# EAGLE design M930C (EAGLE 6.6.0)
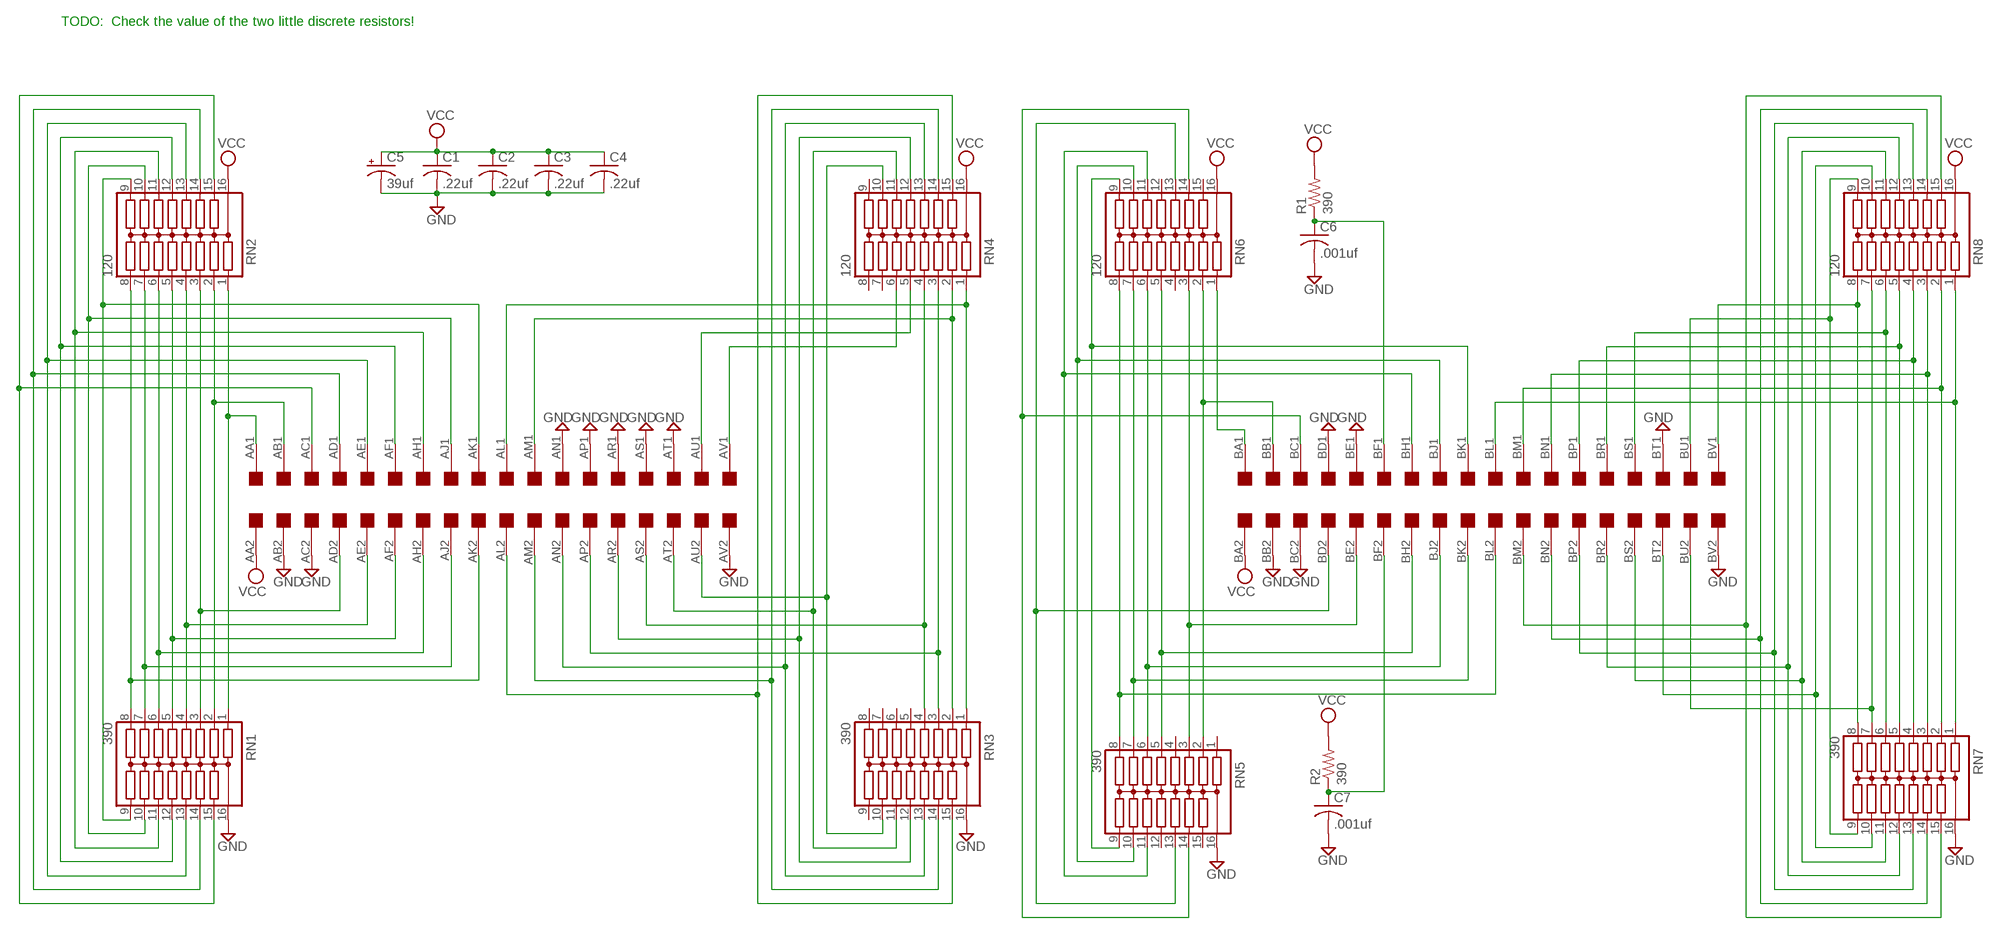
[diagram p0: schematic, sheet 1]

## Parts
C1  .22uf  C-US050-025X075  [C050-025X075]
C2  .22uf  C-US050-025X075  [C050-025X075]
C3  .22uf  C-US050-025X075  [C050-025X075]
C4  .22uf  C-US050-025X075  [C050-025X075]
C5  39uf  CPOL-USE15-5AXIAL  [E15-5]
C6  .001uf  C-US050-025X075  [C050-025X075]
C7  .001uf  C-US050-025X075  [C050-025X075]
R1  390  R-US_0207/10  [0207/10]
R2  390  R-US_0207/10  [0207/10]
RN1  390  15R  [DIL16]
RN2  120  15R  [DIL16]
RN3  390  15R  [DIL16]
RN4  120  15R  [DIL16]
RN5  390  15R  [DIL16]
RN6  120  15R  [DIL16]
RN7  390  15R  [DIL16]
RN8  120  15R  [DIL16]
U$1  DOUBLE  [EDGE-CON4]

## Nets
AA1: RN1.1 RN2.1 U$1.AA1
AB1: RN1.2 RN2.2 U$1.AB1
AC1: RN1.15 RN2.15 U$1.AC1
AD1: RN1.14 RN2.14 U$1.AD1
AD2: RN1.3 RN2.3 U$1.AD2
AE1: RN1.13 RN2.13 U$1.AE1
AE2: RN1.4 RN2.4 U$1.AE2
AF1: RN1.12 RN2.12 U$1.AF1
AF2: RN1.5 RN2.5 U$1.AF2
AH1: RN1.11 RN2.11 U$1.AH1
AH2: RN1.6 RN2.6 U$1.AH2
AJ1: RN1.10 RN2.10 U$1.AJ1
AJ2: RN1.7 RN2.7 U$1.AJ2
AK1: RN1.9 RN2.9 U$1.AK1
AK2: RN1.8 RN2.8 U$1.AK2
AL1: RN3.1 RN4.1 U$1.AL1
AL2: RN3.15 RN4.15 U$1.AL2
AM1: RN3.2 RN4.2 U$1.AM1
AM2: RN3.14 RN4.14 U$1.AM2
AN2: RN3.13 RN4.13 U$1.AN2
AP2: RN3.3 RN4.3 U$1.AP2
AR2: RN3.12 RN4.12 U$1.AR2
AS2: RN3.4 RN4.4 U$1.AS2
AT2: RN3.11 RN4.11 U$1.AT2
AU1: RN4.5 U$1.AU1
AU2: RN3.10 RN4.10 U$1.AU2
AV1: RN4.6 U$1.AV1
BA1: RN6.1 U$1.BA1
BB1: RN5.2 RN6.2 U$1.BB1
BC1: RN5.14 RN6.14 U$1.BC1
BD2: RN5.13 RN6.13 U$1.BD2
BE2: RN5.3 RN6.3 U$1.BE2
BH1: RN5.11 RN6.11 U$1.BH1
BH2: RN5.5 RN6.5 U$1.BH2
BJ1: RN5.10 RN6.10 U$1.BJ1
BJ2: RN5.6 RN6.6 U$1.BJ2
BK1: RN5.9 RN6.9 U$1.BK1
BK2: RN5.7 RN6.7 U$1.BK2
BL1: RN7.1 RN8.1 U$1.BL1
BL2: RN5.8 RN6.8 U$1.BL2
BM1: RN7.2 RN8.2 U$1.BM1
BM2: RN7.15 RN8.15 U$1.BM2
BN1: RN7.3 RN8.3 U$1.BN1
BN2: RN7.14 RN8.14 U$1.BN2
BP1: RN7.4 RN8.4 U$1.BP1
BP2: RN7.13 RN8.13 U$1.BP2
BR1: RN7.5 RN8.5 U$1.BR1
BR2: RN7.12 RN8.12 U$1.BR2
BS1: RN7.6 RN8.6 U$1.BS1
BS2: RN7.11 RN8.11 U$1.BS2
BT2: RN7.10 RN8.10 U$1.BT2
BU1: RN7.9 RN8.9 U$1.BU1
BU2: RN7.7 RN8.7 U$1.BU2
BV1: RN7.8 RN8.8 U$1.BV1
GND: C1.2 C2.2 C3.2 C4.2 C5.- C6.2 C7.2 RN1.16 RN3.16 RN5.16 RN7.16 U$1.AB2 U$1.AC2 U$1.AN1 U$1.AP1 U$1.AR1 U$1.AS1 U$1.AT1 U$1.AV2 U$1.BB2 U$1.BC2 U$1.BD1 U$1.BE1 U$1.BT1 U$1.BV2
N$1: C7.1 R2.1 U$1.BF2
N$2: C6.1 R1.1 U$1.BF1
VCC: C1.1 C2.1 C3.1 C4.1 C5.+ R1.2 R2.2 RN2.16 RN4.16 RN6.16 RN8.16 U$1.AA2 U$1.BA2
Unconnected: RN3.5 RN3.6 RN3.7 RN3.8 RN3.9 RN4.7 RN4.8 RN4.9 RN5.1 RN5.4 RN5.12 RN5.15 RN6.4 RN6.12 RN6.15

## Notes on the sheet
- TODO:  Check the value of the two little discrete resistors!

## Library data of the parts
C1-C4 C6 C7 = rcl:C-US: CAPACITOR, American symbol
C5 = rcl:CPOL-US: POLARIZED CAPACITOR, American symbol
R1 R2 = rcl:R-US_: RESISTOR, American symbol
RN1-RN8 = resistor-dil:15R: DIL RESISTOR; OC_FARNELL: unknown; OC_NEWARK: unknown
U$1 = dec-con:DOUBLE: Double-Height DEC board

## Board
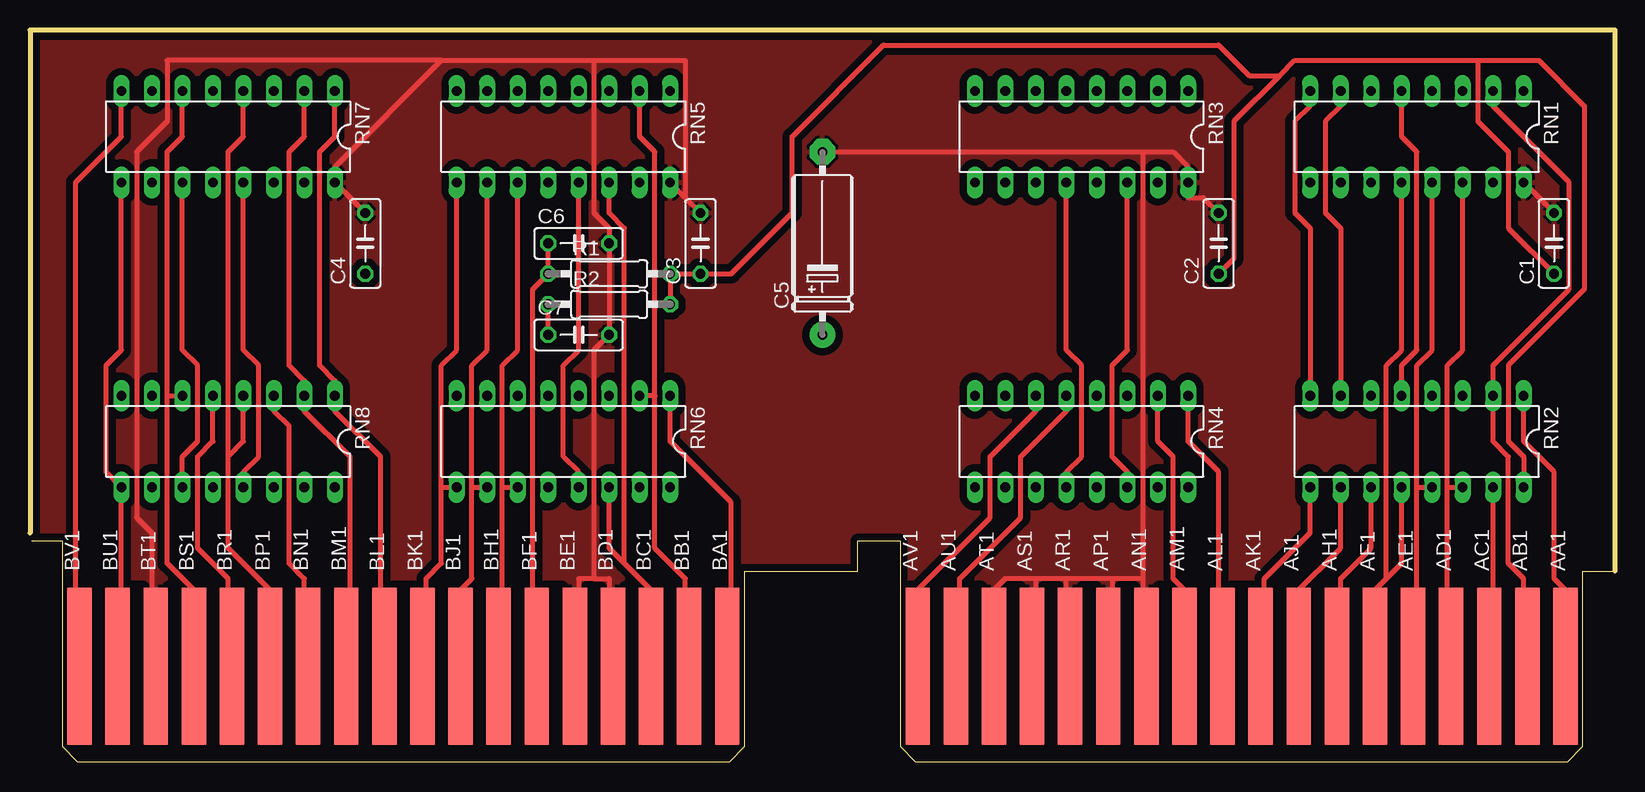
[diagram p1: board, top side]
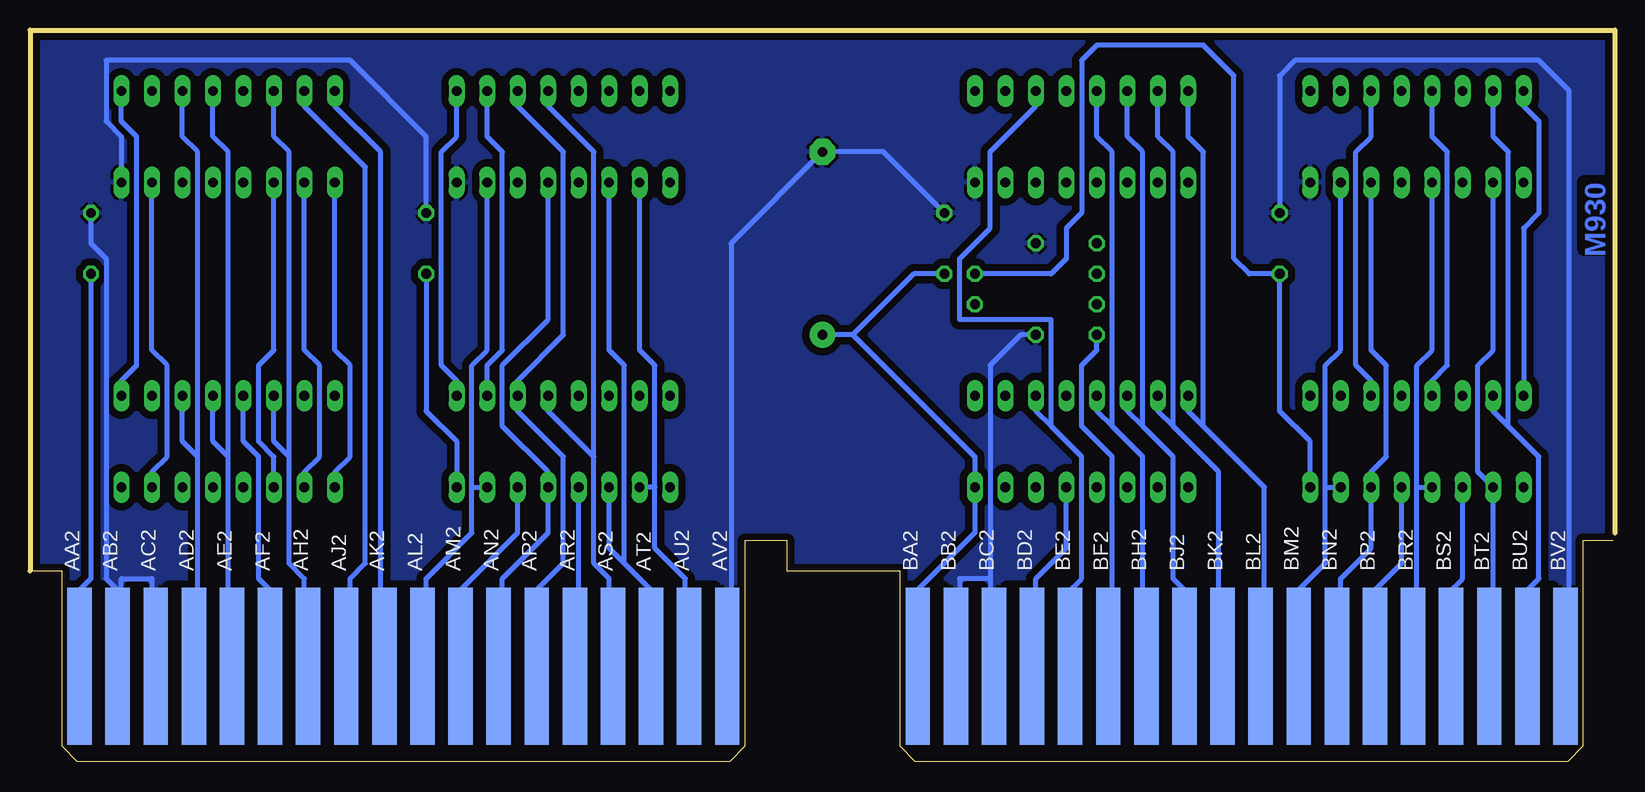
[diagram p2: board, bottom side, seen from below]

Size 132.08 x 60.96 mm. Coordinates in mm from the lower left corner, seen from the top.
Outline: 132.08,15.88 132.08,60.96 0,60.96 0,19.05
Copper layers (1+16): Top 0.035mm / dielectric 1.5mm / Bottom 0.035mm
Design rules "16mils": minimum track width 16mil, minimum drill 32mil, track to track 15mil, track to pad 10mil, pad to pad 10mil, via to via 10mil, smd to smd 10mil, copper to edge 13mil, drill to drill 10mil, minimum pad ring 10mil, minimum via ring 8mil, stop-mask expansion 0mil, vias tented up to drill 0mil, thermal gap 10mil

### Footprints (pad centres in the part's own frame; a part is rotated, then mirrored left to right if it is on the bottom)
C050-025X075 = drill 0.813 octagon: 1 -2.54,0; 2 2.54,0
E15-5 = drill 0.813 pad 2.159: + -7.62,0 | drill 0.813 pad 2.159 octagon: - 7.62,0
0207/10 = drill 0.813 octagon: 1 -5.08,0; 2 5.08,0
DIL16 = drill 0.813 long: 1 -8.89,-3.81; 2 -6.35,-3.81; 3 -3.81,-3.81; 4 -1.27,-3.81; 5 1.27,-3.81; 6 3.81,-3.81; 7 6.35,-3.81; 8 8.89,-3.81; 9 8.89,3.81; 10 6.35,3.81; 11 3.81,3.81; 12 1.27,3.81; 13 -1.27,3.81; 14 -3.81,3.81; 15 -6.35,3.81; 16 -8.89,3.81
EDGE-CON4 = smd 13.106 x 2.032: AA1 7.938,4.128; AB1 7.938,7.303; AC1 7.938,10.477; AD1 7.938,13.652; AE1 7.938,16.828; AF1 7.938,20.003; AH1 7.938,23.177; AJ1 7.938,26.352; AK1 7.938,29.527; AL1 7.938,32.703; AM1 7.938,35.877; AN1 7.938,39.053; AP1 7.938,42.227; AR1 7.938,45.403; AS1 7.938,48.578; AT1 7.938,51.752; AU1 7.938,54.928; AV1 7.938,58.102; BA1 7.938,73.978; BB1 7.938,77.153; BC1 7.938,80.328; BD1 7.938,83.502; BE1 7.938,86.677; BF1 7.938,89.853; BH1 7.938,93.028; BJ1 7.938,96.203; BK1 7.938,99.377; BL1 7.938,102.552; BM1 7.938,105.728; BN1 7.938,108.903; BP1 7.938,112.078; BR1 7.938,115.252; BS1 7.938,118.427; BT1 7.938,121.603; BU1 7.938,124.778; BV1 7.938,127.953 | smd 13.106 x 2.032 bottom: AA2 7.938,4.128; AB2 7.938,7.303; AC2 7.938,10.477; AD2 7.938,13.652; AE2 7.938,16.828; AF2 7.938,20.003; AH2 7.938,23.177; AJ2 7.938,26.352; AK2 7.938,29.527; AL2 7.938,32.703; AM2 7.938,35.877; AN2 7.938,39.053; AP2 7.938,42.227; AR2 7.938,45.403; AS2 7.938,48.578; AT2 7.938,51.752; AU2 7.938,54.928; AV2 7.938,58.102; BA2 7.938,73.978; BB2 7.938,77.153; BC2 7.938,80.328; BD2 7.938,83.502; BE2 7.938,86.677; BF2 7.938,89.853; BH2 7.938,93.028; BJ2 7.938,96.203; BK2 7.938,99.377; BL2 7.938,102.552; BM2 7.938,105.728; BN2 7.938,108.903; BP2 7.938,112.078; BR2 7.938,115.252; BS2 7.938,118.427; BT2 7.938,121.603; BU2 7.938,124.778; BV2 7.938,127.953

### Placement (x,y rotation side)
C1  127,43.18 90 top
C2  99.06,43.18 90 top
C3  55.88,43.18 90 top
C4  27.94,43.18 90 top
C5  66.04,43.18 90 top
C6  45.72,43.18 0 top
C7  45.72,35.56 0 top
R1  48.26,40.64 0 top
R2  48.26,38.1 0 top
RN1  115.57,52.07 180 top
RN2  115.57,26.67 180 top
RN3  87.63,52.07 180 top
RN4  87.63,26.67 180 top
RN5  44.45,52.07 180 top
RN6  44.45,26.67 180 top
RN7  16.51,52.07 180 top
RN8  16.51,26.67 180 top
U$1  132.08,0 90 top

### Tracks (layer width: path | path; a pad name or v marks a point on that pad's centre or on a via)
AA1
  Top 0.406: RN2.1 124.46,26.67 127,24.13 127,15.24 128.27,13.97 U$1.AA1
  Bottom 0.406: RN1.1 124.46,53.34 123.19,52.07 123.19,33.02 124.46,31.75 RN2.1
AB1
  Top 0.406: U$1.AB1 124.46,13.97 124.46,15.24 123.19,16.51 123.19,25.4 121.92,26.67 RN2.2 121.92,33.02 128.27,39.37 128.27,48.26 121.92,54.61 RN1.2
AC1
  Top 0.406: RN2.15 121.92,21.59 121.92,13.97 U$1.AC1
  Bottom 0.406: RN1.15 121.92,46.99 121.92,34.29 120.65,33.02 120.65,25.4 121.92,24.13 RN2.15
AD1
  Top 0.406: 118.11,22.86 RN2.14 | 118.11,13.97 118.11,8.89 118.43,8.57 U$1.AD1 118.11,13.97 | RN1.14 119.38,34.29 118.11,33.02 118.11,22.86 | 118.11,13.97 118.11,22.86
AD2
  Bottom 0.406: 118.11,25.4 119.38,26.67 119.38,29.21 RN2.3 | 118.11,25.4 118.11,13.97 U$1.AD2 | 118.11,25.4 118.11,50.8 119.38,52.07 119.38,54.61 RN1.3
AE1
  Top 0.406: 115.57,22.86 RN2.13 | RN1.13 116.84,34.29 115.57,33.02 115.57,22.86 | 115.57,22.86 115.57,13.97 U$1.AE1
AE2
  Bottom 0.406: 115.57,25.4 116.84,26.67 116.84,29.21 RN2.4 | 115.57,25.4 115.57,13.97 U$1.AE2 | 115.57,25.4 115.57,50.8 116.84,52.07 116.84,54.61 RN1.4
AF1
  Top 0.406: 113.03,15.24 111.76,13.97 U$1.AF1 | 113.03,15.24 114.3,16.51 114.3,21.59 RN2.12 | 113.03,15.24 113.03,33.02 114.3,34.29 114.3,46.99 RN1.12
AF2
  Top 0.406: RN1.5 114.3,52.07 115.57,50.8 115.57,34.29 114.3,33.02 RN2.5
  Bottom 0.406: RN2.5 114.3,26.67 113.03,25.4 113.03,15.24 111.76,13.97 U$1.AF2
AH1
  Top 0.406: RN2.11 111.76,17.78 109.22,15.24 109.22,13.97 U$1.AH1
  Bottom 0.406: RN1.11 111.76,34.29 113.03,33.02 113.03,26.67 111.76,25.4 RN2.11
AH2
  Bottom 0.406: RN2.6 111.76,26.67 110.49,25.4 | 110.49,25.4 110.49,16.51 109.22,15.24 109.22,13.97 U$1.AH2 | RN1.6 111.76,52.07 110.49,50.8 110.49,25.4
AJ1
  Top 0.406: RN2.10 109.22,21.59 109.22,17.78 105.41,13.97 U$1.AJ1
  Bottom 0.406: RN1.10 109.22,46.99 109.22,34.29 107.95,33.02 107.95,25.4 109.22,24.13 RN2.10
AJ2
  Top 0.406: RN2.7 109.22,44.45 107.95,45.72 107.95,53.34 109.22,54.61 RN1.7
  Bottom 0.406: RN1.7 109.22,54.61 104.14,49.53 104.14,16.51 105.41,15.24 105.41,13.97 U$1.AJ2
AK1
  Top 0.406: RN2.9 106.68,19.05 102.87,15.24 102.87,13.97 U$1.AK1
  Bottom 0.406: RN1.9 106.68,34.29 105.41,33.02 105.41,25.4 106.68,24.13 RN2.9
AK2
  Top 0.406: RN2.8 106.68,31.75 106.68,44.45 105.41,45.72 105.41,53.34 106.68,54.61 RN1.8
  Bottom 0.406: RN1.8 106.68,54.61 102.87,50.8 102.87,13.97 U$1.AK2
AL1
  Top 0.406: RN4.1 96.52,29.21 96.52,26.67 99.06,24.13 99.06,13.97 U$1.AL1
  Bottom 0.406: RN3.1 96.52,54.61 96.52,52.07 97.79,50.8 97.79,33.02 96.52,31.75 RN4.1
AL2
  Bottom 0.406: 95.25,22.86 RN4.15 | U$1.AL2 99.06,13.97 99.06,15.24 95.25,19.05 95.25,22.86 | RN3.15 93.98,34.29 95.25,33.02 95.25,22.86
AM1
  Top 0.406: RN4.2 93.98,26.67 95.25,25.4 95.25,15.24 96.52,13.97 U$1.AM1
  Bottom 0.406: RN3.2 93.98,52.07 92.71,50.8 92.71,34.29 93.98,33.02 RN4.2
AM2
  Top 0.406: RN3.14 91.44,46.99 91.44,34.29 90.17,33.02 90.17,25.4 91.44,24.13 RN4.14
  Bottom 0.406: RN4.14 91.44,21.59 91.44,19.05 96.52,13.97 U$1.AM2
AN2
  Bottom 0.406: U$1.AN2 92.71,13.97 92.71,15.24 88.9,19.05 RN4.13 88.9,24.13 92.71,27.94 92.71,33.02 88.9,36.83 RN3.13
AP2
  Bottom 0.406: U$1.AP2 90.17,13.97 87.63,16.51 87.63,25.4 91.44,29.21 RN4.3 91.44,31.75 87.63,35.56 87.63,50.8 91.44,54.61 RN3.3
AR2
  Top 0.406: RN3.12 86.36,46.99 86.36,34.29 87.63,33.02 87.63,25.4 86.36,24.13 RN4.12
  Bottom 0.406: RN4.12 86.36,21.59 86.36,13.97 U$1.AR2
AS2
  Bottom 0.406: 85.09,25.4 88.9,29.21 RN4.4 | 85.09,25.4 85.09,16.51 83.82,15.24 83.82,13.97 U$1.AS2 | 85.09,25.4 85.09,50.8 88.9,54.61 RN3.4
AT2
  Bottom 0.406: 82.55,16.51 80.01,13.97 U$1.AT2 | 82.55,16.51 83.82,17.78 83.82,21.59 RN4.11 | 82.55,16.51 82.55,33.02 83.82,34.29 83.82,46.99 RN3.11
AU1
  Top 0.406: RN4.5 86.36,29.21 82.55,25.4 82.55,20.32 77.47,15.24 77.47,13.97 U$1.AU1
AU2
  Bottom 0.406: 80.01,22.86 RN4.10 | U$1.AU2 77.47,13.97 77.47,15.24 80.01,17.78 80.01,22.86 | RN3.10 81.28,34.29 80.01,33.02 80.01,22.86
AV1
  Top 0.406: RN4.6 83.82,29.21 80.01,25.4 80.01,20.32 73.66,13.97 U$1.AV1
BA1
  Top 0.406: RN6.1 53.34,26.67 58.42,21.59 58.42,12.7 U$1.BA1
BB1
  Top 0.406: 52.07,30.48 RN6.2 | 52.07,30.48 52.07,17.78 54.61,15.24 54.61,13.97 U$1.BB1 | RN5.2 50.8,52.07 52.07,50.8 52.07,30.48
BC1
  Top 0.406: 49.53,16.51 52.07,13.97 U$1.BC1 | 49.53,16.51 48.26,17.78 48.26,21.59 RN6.14 | 49.53,16.51 49.53,44.45 48.26,45.72 48.26,46.99 RN5.14
BD2
  Top 0.406: RN5.13 45.72,34.29 44.45,33.02 44.45,25.4 45.72,24.13 RN6.13
  Bottom 0.406: RN6.13 45.72,17.78 48.26,15.24 48.26,13.97 U$1.BD2
BE2
  Bottom 0.406: 46.99,27.94 44.45,25.4 44.45,15.24 45.72,13.97 U$1.BE2 | 46.99,27.94 48.26,29.21 RN6.3 | 46.99,27.94 46.99,36.83 54.61,36.83 54.61,41.91 52.07,44.45 52.07,50.8 48.26,54.61 RN5.3
BH1
  Top 0.406: 39.37,22.86 RN6.11 | RN5.11 40.64,34.29 39.37,33.02 39.37,22.86 | U$1.BH1 39.05,13.65 39.37,13.97 39.37,22.86
BH2
  Bottom 0.406: 41.91,27.94 39.37,25.4 39.37,13.97 U$1.BH2 | 41.91,27.94 43.18,29.21 RN6.5 | 41.91,27.94 41.91,50.8 43.18,52.07 43.18,54.61 RN5.5
BJ1
  Top 0.406: 36.83,22.86 RN6.10 | U$1.BJ1 35.56,13.97 36.83,15.24 36.83,22.86 | RN5.10 38.1,34.29 36.83,33.02 36.83,22.86
BJ2
  Bottom 0.406: 39.37,27.94 36.83,25.4 36.83,15.24 35.56,13.97 U$1.BJ2 | 39.37,27.94 40.64,29.21 RN6.6 | RN5.6 40.64,52.07 39.37,50.8 39.37,27.94
BK1
  Top 0.406: 34.29,22.86 RN6.9 | U$1.BK1 33.02,13.97 33.02,15.24 34.29,16.51 34.29,22.86 | RN5.9 35.56,34.29 34.29,33.02 34.29,22.86
BK2
  Bottom 0.406: 36.83,27.94 33.02,24.13 33.02,13.97 U$1.BK2 | 36.83,27.94 38.1,29.21 RN6.7 | 36.83,27.94 36.83,50.8 38.1,52.07 38.1,54.61 RN5.7
BL1
  Top 0.406: U$1.BL1 29.21,13.97 29.21,25.4 25.4,29.21 RN8.1 25.4,31.75 24.13,33.02 24.13,50.8 25.4,52.07 25.4,54.61 RN7.1
BL2
  Bottom 0.406: 34.29,27.94 29.21,22.86 29.21,12.7 U$1.BL2 | 34.29,27.94 35.56,29.21 RN6.8 | RN5.8 35.56,52.07 34.29,50.8 34.29,27.94
BM1
  Top 0.406: U$1.BM1 26.67,13.97 26.67,25.4 22.86,29.21 RN8.2 22.86,31.75 21.59,33.02 21.59,50.8 22.86,52.07 22.86,54.61 RN7.2
BM2
  Bottom 0.406: 24.13,22.86 RN8.15 | U$1.BM2 26.67,13.97 24.13,16.51 24.13,22.86 | RN7.15 22.86,34.29 24.13,33.02 24.13,22.86
BN1
  Top 0.406: RN8.3 20.32,29.21 21.59,27.94 21.59,16.51 22.86,15.24 22.86,13.97 U$1.BN1
  Bottom 0.406: RN7.3 20.32,52.07 21.59,50.8 21.59,33.02 20.32,31.75 RN8.3
BN2
  Bottom 0.406: U$1.BN2 22.86,13.97 22.86,15.24 20.32,17.78 RN8.14 20.32,24.13 19.05,25.4 19.05,33.02 20.32,34.29 RN7.14
BP1
  Top 0.406: 16.51,25.4 17.78,26.67 17.78,29.21 RN8.4 | 16.51,25.4 16.51,17.78 20.32,13.97 U$1.BP1 | 16.51,25.4 16.51,50.8 17.78,52.07 17.78,54.61 RN7.4
BP2
  Top 0.406: RN7.13 17.78,46.99 17.78,34.29 19.05,33.02 19.05,25.4 17.78,24.13 RN8.13
  Bottom 0.406: RN8.13 17.78,21.59 17.78,16.51 20.32,13.97 U$1.BP2
BR1
  Top 0.406: RN8.5 15.24,26.67 13.97,25.4 13.97,17.78 16.51,15.24 16.51,13.97 U$1.BR1
  Bottom 0.406: RN7.5 15.24,52.07 13.97,50.8 13.97,33.02 15.24,31.75 RN8.5
BR2
  Bottom 0.406: 16.51,22.86 RN8.12 | RN7.12 15.24,34.29 16.51,33.02 16.51,22.86 | U$1.BR2 16.83,13.65 16.51,13.97 16.51,22.86
BS1
  Top 0.406: 11.43,30.48 RN8.6 | 11.43,30.48 11.43,16.51 13.97,13.97 U$1.BS1 | RN7.6 12.7,52.07 11.43,50.8 11.43,30.48
BS2
  Top 0.406: RN7.11 12.7,34.29 13.97,33.02 13.97,26.67 12.7,25.4 RN8.11
  Bottom 0.406: RN8.11 12.7,15.24 13.97,13.97 U$1.BS2
BT2
  Bottom 0.406: RN8.10 10.16,13.97 U$1.BT2 10.48,8.57 10.16,8.89 RN8.10 | RN7.10 10.16,34.29 11.43,33.02 11.43,24.13 RN8.10
BU1
  Top 0.406: RN7.9 7.62,34.29 6.35,33.02 6.35,24.13 RN8.9 7.62,8.89 7.3,8.57 U$1.BU1
BU2
  Bottom 0.406: 8.89,27.94 6.35,25.4 6.35,15.24 7.62,13.97 U$1.BU2 | 8.89,27.94 10.16,29.21 RN8.7 | RN7.7 10.16,52.07 8.89,50.8 8.89,27.94
BV1
  Top 0.406: RN7.8 7.62,52.07 3.81,48.26 3.81,12.7 U$1.BV1
  Bottom 0.406: RN8.8 7.62,44.45 6.35,45.72 6.35,53.34 7.62,54.61 RN7.8
GND
  Top 0.406: RN1.16 C1.2 | 83.82,15.24 81.28,15.24 80.01,13.97 U$1.AT1 | 90.17,15.24 86.36,15.24 | 92.71,15.24 90.17,15.24 | 90.17,15.24 90.17,13.97 U$1.AP1 | 86.36,15.24 83.82,15.24 | 83.82,15.24 83.82,13.97 U$1.AS1 | U$1.AR1 86.36,13.97 86.36,15.24 | 46.99,15.24 48.26,15.24 48.26,13.97 U$1.BD1 | C2.2 97.79,46.99 96.52,46.99 RN3.16 96.52,49.53 95.25,50.8 92.71,50.8 | C4.2 RN7.16 25.4,49.53 34.29,58.42 | 54.61,46.99 RN5.16 | 54.61,46.99 C3.2 | 46.99,58.42 54.61,58.42 54.61,46.99 | 34.29,58.42 46.99,58.42 | C5.- 92.71,50.8 | 46.99,58.42 46.99,45.72 48.26,44.45 C6.2 C7.2 46.99,34.29 46.99,15.24 | 34.29,58.42 11.43,58.42 11.43,53.34 8.89,50.8 8.89,20.32 10.16,19.05 10.16,13.97 U$1.BT1 | 46.99,15.24 45.72,15.24 45.72,13.97 U$1.BE1 | 92.71,50.8 92.71,15.24 | 92.71,15.24 92.71,13.97 U$1.AN1
  Bottom 0.406: C1.2 127,43.18 125.73,41.91 125.73,15.24 124.46,13.97 | U$1.AC2 121.92,13.97 121.92,15.24 124.46,15.24 124.46,13.97 | U$1.AB2 124.46,13.97 | 52.07,15.24 54.61,15.24 54.61,13.97 U$1.BB2 | C3.2 60.96,50.8 C5.- 73.66,43.18 73.66,13.97 U$1.AV2 73.66,12.7 74.26,12.7 | C4.2 27.94,57.15 26.67,58.42 6.35,58.42 3.81,55.88 3.81,12.7 U$1.BV2 | 52.07,15.24 52.07,33.02 49.53,35.56 C7.2 | 52.07,15.24 52.07,13.97 U$1.BC2 | RN1.16 124.46,52.07 125.73,53.34 125.73,58.42 105.41,58.42 99.06,52.07 C2.2
  pour Bottom (isolate 0.61): 0,60.96 132.08,60.96 132.08,12.7 0,12.7
  pour Top (isolate 0.61): 0,60.96 132.08,60.96 132.08,12.7 0,12.7
N$1
  Top 0.406: C7.1 R2.1
  Bottom 0.406: C7.1 43.18,34.29 44.45,33.02 44.45,27.94 41.91,25.4 41.91,13.97 U$1.BF2
N$2
  Top 0.406: C6.1 R1.1 41.91,39.37 41.91,13.97 U$1.BF1
VCC
  Top 0.406: 120.65,58.42 105.41,58.42 104.14,57.15 | 120.65,58.42 125.73,58.42 129.54,54.61 129.54,39.37 123.19,33.02 123.19,26.67 124.46,25.4 RN2.16 | 104.14,57.15 100.33,53.34 100.33,41.91 C2.1 | C1.1 123.19,44.45 123.19,50.8 120.65,53.34 120.65,58.42 | R2.2 R1.2 C3.1 58.42,40.64 63.5,45.72 63.5,52.07 71.12,59.69 99.06,59.69 101.6,57.15 104.14,57.15
  Bottom 0.406: C1.1 127,15.24 128.27,13.97 U$1.AA2 | RN4.16 96.52,26.67 99.06,29.21 C2.1 | U$1.BA2 58.42,13.97 53.34,19.05 RN6.16 53.34,25.4 63.5,35.56 | RN8.16 25.4,26.67 27.94,29.21 C4.1 30.48,40.64 31.75,41.91 31.75,57.15 34.29,59.69 43.18,59.69 44.45,58.42 44.45,45.72 45.72,44.45 45.72,41.91 46.99,40.64 R1.2 | 63.5,35.56 C5.+ | 63.5,35.56 58.42,40.64 C3.1

### Text on the board
Bottom: M930
tValues: M930C Unibus Terminator